# Altium project PIC24E_Extension_Project.PrjPcb
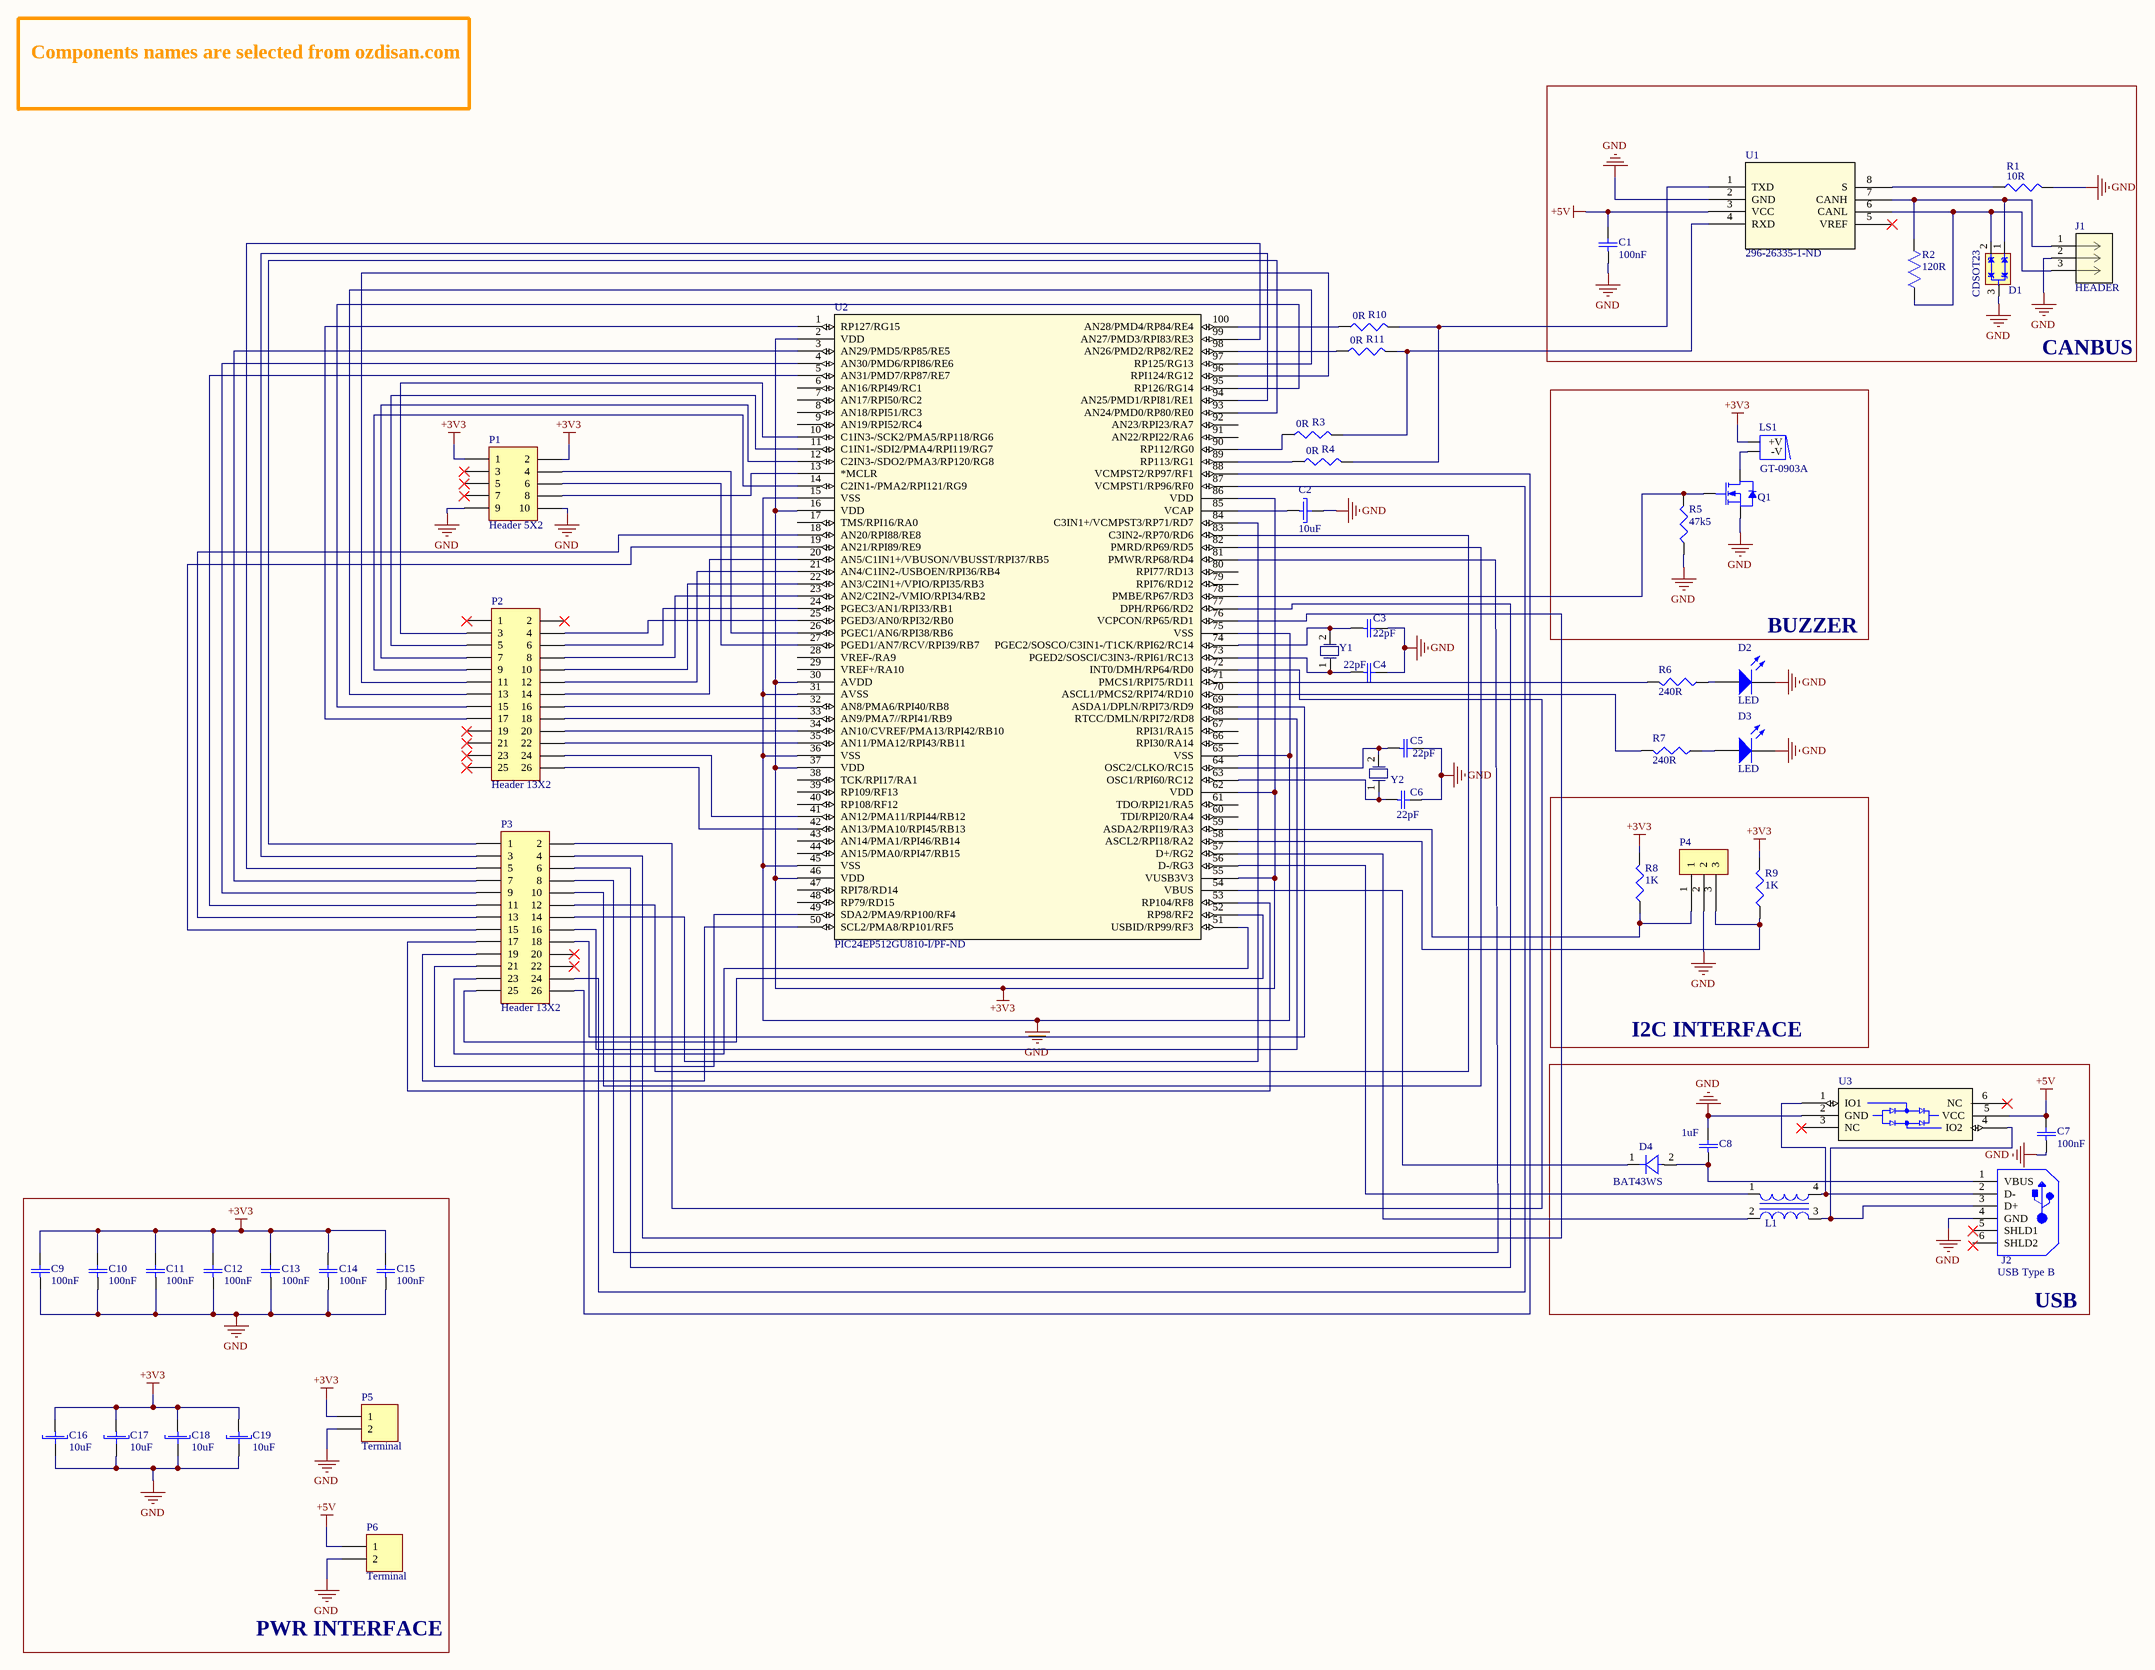
[diagram p0: PIC24E_Extension_Schematics.SchDoc]
1 sheet, 50 parts. Net scope: global (net labels, ports and power ports of the same name join across sheets).
Board file: PIC24E_Extension_PCB.PcbDoc

## Sheet PIC24E_Extension_Schematics.SchDoc
size A2

### Parts
C1  100nF  [C1206]
C2  10uF  [C1206 - TANT]
C3  22pF  [C1206]
C4  22pF  [C1206]
C5  22pF  [C1206]
C6  22pF  [C1206]
C7  100nF  [C1206]
C8  1uF  [C1206]
C9  100nF  [C1206]
C10  100nF  [C1206]
C11  100nF  [C1206]
C12  100nF  [C1206]
C13  100nF  [C1206]
C14  100nF  [C1206]
C15  100nF  [C1206]
C16  10uF  [C1206 - TANT]
C17  10uF  [C1206 - TANT]
C18  10uF  [C1206 - TANT]
C19  10uF  [C1206 - TANT]
D1  CDSOT23  [SOT-23-3]
D2  LED  [D0603_Directional]
D3  LED  [D0603_Directional]
D4  BAT43WS  [SOD323]
J1  HEADER  [TerminalBlock3P508]
J2  USB Type B  [USB-B RECEPTACLE]
L1  ACM2012-900-2P-T002  [ACM2012]  (value not drawn)
LS1  GT-0903A  [GT-0903A]
P1  Header 5X2  [HDR2X5]
P2  Header 13X2  [HDR2X13]
P3  Header 13X2  [HDR2X13]
P4  76384-303LF  [HDR_1x3_2.54MM_SHDR_V2]  (value not drawn)
P5  Terminal  [SRW_TRM]
P6  Terminal  [SRW_TRM]
Q1  MOSFET N-CH 20V 1A SOT323  [SC70_SOT323]  (value not drawn)
R1  10R  [R1206]
R2  120R  [R1206]
R3  0R  [R1206]
R4  0R  [R1206]
R5  47k5  [R1206]
R6  240R  [R1206]
R7  240R  [R1206]
R8  1K  [R1206]
R9  1K  [R1206]
R10  0R  [R1206]
R11  0R  [R1206]
U1  296-26335-1-ND  [D8]
U2  PIC24EP512GU810-I/PF-ND  [TQFP100_14x14MC]
U3  TVS DIODE 5V 8.1V SOT23-6  [21-0058I]  (value not drawn)
Y1  XTAL-32.7680kHz  [C0805 - OSC]  (value not drawn)
Y2  XTAL-8MHz  [HC49/US]  (value not drawn)

### Blocks framed on the sheet
CANBUS: C1 D1 J1 R1 R2 U1
BUZZER: LS1 Q1 R5
I2C INTERFACE: P4 R8 R9
USB: C7 C8 D4 J2 L1 U3
PWR INTERFACE: C9-C19 P5 P6

### Nets
+3V3: C9.2 C10.2 C11.2 C12.2 C13.2 C14.2 C15.2 C16.1 C17.1 C18.1 C19.1 LS1.1(+V) P1.1 P1.2 P5.1 R8.2 R9.2 U2.2(VDD) U2.16(VDD) U2.30(AVDD) U2.37(VDD) U2.46(VDD) U2.55(VUSB3V3) U2.62(VDD) U2.86(VDD)
+5V: C1.2 C7.2 P6.1 U1.3(VCC) U3.5(VCC)
GND: C1.1 C2.2 C3.2 C4.2 C5.2 C6.2 C7.1 C8.2 C9.1 C10.1 C11.1 C12.1 C13.1 C14.1 C15.1 C16.2 C17.2 C18.2 C19.2 D1.3 D2.2(K) D3.2(K) J1.2 J2.4(GND) P1.9 P1.10 P4.2 P5.2 P6.2 Q1.2(S) R1.2 R5.1 U1.2(GND) U2.15(VSS) U2.31(AVSS) U2.36(VSS) U2.45(VSS) U2.65(VSS) U2.75(VSS) U3.2(GND)
NetC2_1: C2.1 U2.85(VCAP)
NetC3_1: C3.1 U2.74(PGEC2/SOSCO/C3IN1-/T1CK/RPI62/RC14) Y1.2
NetC4_1: C4.1 U2.73(PGED2/SOSCI/C3IN3-/RPI61/RC13) Y1.1
NetC5_1: C5.1 U2.64(OSC2/CLKO/RC15) Y2.2
NetC6_1: C6.1 U2.63(OSC1/RPI60/RC12) Y2.1
NetC8_1: C8.1 D4.2 J2.1(VBUS)
NetD1_1: D1.1 J1.1 R2.2 U1.7(CANH)
NetD1_2: D1.2 J1.3 R2.1 U1.6(CANL)
NetD2_1: D2.1(A) R6.1
NetD3_1: D3.1(A) R7.1
NetD4_1: D4.1 U2.54(VBUS)
NetJ2_2: J2.2(D-) L1.4 U3.1(IO1)
NetJ2_3: J2.3(D+) L1.3 U3.4(IO2)
NetL1_1: L1.1 U2.56(D-/RG3)
NetL1_2: L1.2 U2.57(D+/RG2)
NetLS1_2: LS1.2(-V) Q1.3(D)
NetP1_4: P1.4 U2.26(PGEC1/AN6/RPI38/RB6)
NetP1_6: P1.6 U2.27(PGED1/AN7/RCV/RPI39/RB7)
NetP1_8: P1.8 U2.13(*MCLR)
NetP2_3: P2.3 U2.10(C1IN3-/SCK2/PMA5/RP118/RG6)
NetP2_4: P2.4 U2.25(PGED3/AN0/RPI32/RB0)
NetP2_5: P2.5 U2.11(C1IN1-/SDI2/PMA4/RPI119/RG7)
NetP2_6: P2.6 U2.24(PGEC3/AN1/RPI33/RB1)
NetP2_7: P2.7 U2.12(C2IN3-/SDO2/PMA3/RP120/RG8)
NetP2_8: P2.8 U2.23(AN2/C2IN2-/VMIO/RPI34/RB2)
NetP2_9: P2.9 U2.14(C2IN1-/PMA2/RPI121/RG9)
NetP2_10: P2.10 U2.22(AN3/C2IN1+/VPIO/RPI35/RB3)
NetP2_11: P2.11 U2.96(RPI124/RG12)
NetP2_12: P2.12 U2.21(AN4/C1IN2-/USBOEN/RPI36/RB4)
NetP2_13: P2.13 U2.97(RP125/RG13)
NetP2_14: P2.14 U2.20(AN5/C1IN1+/VBUSON/VBUSST/RPI37/RB5)
NetP2_15: P2.15 U2.95(RP126/RG14)
NetP2_16: P2.16 U2.32(AN8/PMA6/RPI40/RB8)
NetP2_17: P2.17 U2.1(RP127/RG15)
NetP2_18: P2.18 U2.33(AN9/PMA7//RPI41/RB9)
NetP2_20: P2.20 U2.34(AN10/CVREF/PMA13/RPI42/RB10)
NetP2_22: P2.22 U2.35(AN11/PMA12/RPI43/RB11)
NetP2_24: P2.24 U2.41(AN12/PMA11/RPI44/RB12)
NetP2_26: P2.26 U2.42(AN13/PMA10/RPI45/RB13)
NetP3_1: P3.1 U2.93(AN24/PMD0/RP80/RE0)
NetP3_2: P3.2 U2.72(INT0/DMH/RP64/RD0)
NetP3_3: P3.3 U2.94(AN25/PMD1/RPI81/RE1)
NetP3_4: P3.4 U2.76(VCPCON/RP65/RD1)
NetP3_5: P3.5 U2.99(AN27/PMD3/RPI83/RE3)
NetP3_6: P3.6 U2.77(DPH/RP66/RD2)
NetP3_7: P3.7 U2.3(AN29/PMD5/RP85/RE5)
NetP3_8: P3.8 U2.81(PMWR/RP68/RD4)
NetP3_9: P3.9 U2.4(AN30/PMD6/RPI86/RE6)
NetP3_10: P3.10 U2.82(PMRD/RP69/RD5)
NetP3_11: P3.11 U2.5(AN31/PMD7/RP87/RE7)
NetP3_12: P3.12 U2.83(C3IN2-/RP70/RD6)
NetP3_13: P3.13 U2.18(AN20/RPI88/RE8)
NetP3_14: P3.14 U2.84(C3IN1+/VCMPST3/RP71/RD7)
NetP3_15: P3.15 U2.19(AN21/RPI89/RE9)
NetP3_16: P3.16 U2.68(RTCC/DMLN/RPI72/RD8)
NetP3_17: P3.17 U2.53(RP104/RF8)
NetP3_18: P3.18 U2.69(ASDA1/DPLN/RPI73/RD9)
NetP3_19: P3.19 U2.50(SCL2/PMA8/RP101/RF5)
NetP3_21: P3.21 U2.49(SDA2/PMA9/RP100/RF4)
NetP3_23: P3.23 U2.51(USBID/RP99/RF3)
NetP3_24: P3.24 U2.87(VCMPST1/RP96/RF0)
NetP3_25: P3.25 U2.52(RP98/RF2)
NetP3_26: P3.26 U2.88(VCMPST2/RP97/RF1)
NetP4_1: P4.1 R8.1 U2.59(ASDA2/RPI19/RA3)
NetP4_3: P4.3 R9.1 U2.58(ASCL2/RPI18/RA2)
NetQ1_1: Q1.1(G) R5.2 U2.78(PMBE/RP67/RD3)
NetR1_1: R1.1 U1.8(S)
NetR3_1: R3.1 U2.90(RP112/RG0)
NetR3_2: R3.2 R11.2 U1.4(RXD)
NetR4_1: R4.1 U2.89(RP113/RG1)
NetR4_2: R4.2 R10.2 U1.1(TXD)
NetR6_2: R6.2 U2.71(PMCS1/RPI75/RD11)
NetR7_2: R7.2 U2.70(ASCL1/PMCS2/RPI74/RD10)
NetR10_1: R10.1 U2.100(AN28/PMD4/RP84/RE4)
NetR11_1: R11.1 U2.98(AN26/PMD2/RP82/RE2)

Not connected (* = marked no-connect by the designer): J2 5(SHLD1)* 6(SHLD2); P1 3* 5* 7*; P2 1* 2* 19* 21* 23* 25*; P3 20* 22*; U1 5(VREF)*; U2 6(AN16/RPI49/RC1) 7(AN17/RPI50/RC2) 8(AN18/RPI51/RC3) 9(AN19/RPI52/RC4) 17(TMS/RPI16/RA0) 28(VREF-/RA9) 29(VREF+/RA10) 38(TCK/RPI17/RA1) 39(RP109/RF13) 40(RP108/RF12) 43(AN14/PMA1/RPI46/RB14) 44(AN15/PMA0/RPI47/RB15) 47(RPI78/RD14) 48(RP79/RD15) 60(TDI/RPI20/RA4) 61(TDO/RPI21/RA5) 66(RPI30/RA14) 67(RPI31/RA15) 79(RPI76/RD12) 80(RPI77/RD13) 91(AN22/RPI22/RA6) 92(AN23/RPI23/RA7); U3 3(NC)* 6(NC)*

### Notes on the sheet
- Components names are selected from ozdisan.com

### Library data of the parts
C1 C7 C9-C15 = CL05A104KA5NNNC: MLCC (3216) 1206 100nF 100VDC ±10% X7R; Product Name: CL31B104KCFNNNE; Applications: General Purpose
C2 C16-C19 = T491A106K016AT: CAP.TANTAL 10uF 16V 10% A CASE (3216) SMD; Product Name: T491A106K016AT
C3-C6 = CL21A226MOCLRNC: MLCC (3216) 1206 22pF 50VDC ±5% C0G (NP0); Product Name: CL31C220JBCNNNC
C8 = CGA5L3X8R1H105K1: MLCC (3216) 1206 1uF 16VDC ±5% X7R; Product Name: CL31B105JOFNNNE
D1 = CDSOT23: DIODE TVS 24VWM 40VC SOT23; Product Name: CDSOT23-T24CAN
D2 D3 = LS Q976-NR-1: LED RED DIFFUSED 0603 SMD; Manufacturer 1: OSRAM Opto Semiconductors Inc.; Lens Color: White; Millicandela Rating: 104mcd; Lens Style/Size: Rectangle with Flat Top, 1.00mm x 0.80mm; Voltage - Forward (Vf) (Typ): 2V; Current - Test: 20mA; Viewing Angle: 160°; Wavelength - Dominant: 633nm; Wavelength - Peak: 645nm; Published: 8-Jun-2000; LatestRevisionDate: 08-Jul-2005; LatestRevisionNote: Mech Layer 1 removed.; PackageReference: LED-0; Publisher: Altium Limited; PackageDescription: LED; 2 Leads; Supplier 1: Digi-Key; Supplier Part Number 1: 475-2512-1-ND; Manufacturer Part Number 1: LS Q976-NR-1; RoHS: RoHS Compliant; Description 1: LED RED DIFFUSED 0603 SMD; Category: Optoelectronics; Stock 1: 127302; Pricing 1: 1=0.38, 10=0.274, 25=0.202, 100=0.1444, 250=0.0982, 500=0.08664, 1000=0.06787 (USD); Packaging: Cut Tape (CT); Part Status: Active; Color: Red; Lens Transparency: Diffused; Mounting Type: Surface Mount; Features: -; Package / Case: 0603 (1608 Metric); Supplier Device Package: 0603; Size / Dimension: 1.60mm L x 0.80mm W; Height (Max): 0.80mm; ComponentLink1URL: https://dammedia.osram.info/media/resource/hires/osram-dam-2493499/LS%20Q976.pdf; ComponentLink1Description: https://dammedia.osram.info/media/resource/hires/osram-dam-2493499/LS%20Q976.pdf
D4 = BAT43WS-7-F: DIODE SCHOTTKY 30V 200MA SOD323; Manufacturer 1: Diodes Incorporated; Current - Average Rectified (Io): 200mA (DC); Speed: Small Signal =< 200mA (Io), Any Speed; Capacitance @ Vr, F: 10pF @ 1V, 1MHz; Manufacturer Part Number 1: BAT43WS-7-F; RoHS: RoHS Compliant; Stock 1: 45041; Pricing 1: 1=0.47, 10=0.352, 100=0.2028, 500=0.13698, 1000=0.10685 (USD); Packaging: Cut Tape (CT); Part Status: Active; Diode Type: Schottky; Mounting Type: Surface Mount; Package / Case: SC-76, SOD-323; Supplier Device Package: SOD-323; Operating Temperature - Junction: -55°C ~ 125°C; Base Part Number: BAT43WS; ComponentLink1URL: https://www.diodes.com/assets/Datasheets/ds30100.pdf; ComponentLink1Description: https://www.diodes.com/assets/Datasheets/ds30100.pdf; Supplier 1: Digi-Key; Supplier Part Number 1: BAT43WS-FDICT-ND; Description 1: DIODE SCHOTTKY 30V 200MA SOD323; Category: Discrete Semiconductor Products
J1 = 796644-3: PIN HEADER 3PIN(1x3) 2.00mm THT V/T; Product Name: L-KLS1-207B-1-03-S
J2 = 292304-1: CONNECTOR USB B TYPE RIGHT ANGLE 90C CONNFLY; Product Name: DS1099-WN0
L1 = ACM2012-900-2P-T002: CHOKE COMM MODE 90 OHM .4A SMD; Manufacturer: TDK Corporation; Filter Type: Data, Signal Line; Number of Lines: 2; Current: 400mA; DC Resistance (DCR): 190 mOhm Max; Impedance: 90 Ohm; Resistance (Ohms): 8.2K; Power (Watts): 0.063W, 1/16W; Temperature Coefficient: ±100ppm/°C; Tolerance: ±1%; .Checked PCB: CHK; Supplier 1: Digi-Key; Supplier Part Number 1: 445-2207-1-ND; Manufacturer Part Number: ACM2012-900-2P-T002; RoHS: RoHS Compliant; Category: Filters; Stock 1: 175768; Pricing 1: 1=0.48, 10=0.448, 50=0.42, 100=0.364, 500=0.308, 1000=0.252 (USD); Inductance: -; Mounting Type: Surface Mount; Size / Dimension: 0.079" L x 0.047" W (2.00mm x 1.20mm); Height (Max): 0.051" (1.30mm); Package / Case: 0805 (2012 Metric), 4 Lead; Operating Temperature: -25°C ~ 85°C; Packaging: Cut Tape (CT); ComponentLink1URL: http://www.tdk.co.jp/tefe02/e9719_acm2012.pdf; ComponentLink1Description: http://www.tdk.co.jp/tefe02/e9719_acm2012.pdf; Composition: Thick Film; Features: -; Height: 0.016" (0.40mm); Number of Terminations: 2; ComponentLink2URL: http://www.yageo.com/documents/recent/PYu-RC0402_51_RoHS_L_6.pdf; ComponentLink2Description: http://www.yageo.com/documents/recent/PYu-RC0402_51_RoHS_L_6.pdf; .Checked SCH: CHK
LS1 = GT-0903A: AUDIO MAGNETIC XDCR 2-4V TH; Manufacturer 1: Soberton Inc.; Driver Circuitry: Transducer, Externally Driven; Input Type: Zero-Peak Signal; Voltage Range: 2 ~ 4V; Frequency: 2.73kHz; Operating Mode: Single Tone; Sound Pressure Level (SPL): 85dB @ 3V, 10cm; Current - Supply: 80mA; Port Location: Top; Supplier 1: Digi-Key; Supplier Part Number 1: 433-1032-ND; Manufacturer Part Number 1: GT-0903A; RoHS: RoHS Compliant; Description 1: AUDIO MAGNETIC XDCR 2-4V TH; Category: Audio Products; Stock 1: 13944; Pricing 1: 1=0.97, 10=0.774, 25=0.7036, 50=0.658, 100=0.6125, 250=0.56, 500=0.5215, 1000=0.4865, 5000=0.4375 (USD); Packaging: Tray; Part Status: Active; Technology: Magnetic; Duration: -; Operating Temperature: -20°C ~ 60°C; Approvals: -; Ratings: -; Mounting Type: Through Hole; Termination: PC Pins; Size / Dimension: 0.354" Dia (9.00mm); Height - Seated (Max): 0.197" (5.00mm); ComponentLink1URL: http://cirlw3yrzg4afc1x47lv2k18.wpengine.netdna-cdn.com/wp-content/uploads/2016/10/GT-0903A-Rev.A_2016-1.pdf; ComponentLink1Description: http://cirlw3yrzg4afc1x47lv2k18.wpengine.netdna-cdn.com/wp-content/uploads/2016/10/GT-0903A-Rev.A_2016-1.pdf
P1 = Header 5X2: CONNECTOR 2.54MM 10P (5X2) MALE; Product Name: 67997-410HLF
P2 P3 = Header 13X2: PIN HEADER 26PIN(2x13) 2.54mm THT V/T MALE 180 C; Product Name: DS1021-2X13SF11-B
P4 = 76384-303LF: CONN HEADER 3POS .100" STR GOLD; Manufacturer: FCI; Connector Type: Header, Shrouded; Number of Positions: 3; Number of Positions Loaded: All; Pitch: 0.100" (2.54mm); .Creator: MM; .Checked PCB: CHK; Supplier 1: Digi-Key; Manufacturer Part Number: 76384-303LF; RoHS: RoHS Compliant; Category: Connectors, Interconnects; Stock 1: 1441; Pricing 1: 1=0.59, 10=0.556, 25=0.5, 50=0.4444, 100=0.426, 250=0.38892, 500=0.3704, 1000=0.30558, 2500=0.2778 (USD); Packaging: Tube; Contact Type: Male Pin; Number of Rows: 1; Row Spacing: -; Contact Mating Length: 0.197" (5.00mm); Mounting Type: Through Hole; Termination: Solder; Fastening Type: Friction Lock; Features: -; Contact Finish: Gold, GXT™; Contact Finish Thickness: 30µin (0.76µm); Color: Black; ComponentLink1URL: http://portal.fciconnect.com/Comergent//fci/drawing/76384.pdf; ComponentLink1Description: http://portal.fciconnect.com/Comergent//fci/drawing/76384.pdf; Supplier Part Number 1: 609-1305-ND; .Checked SCH: CHK
P5 = Header 2: TERM.BLK.3.50MM 2P PCB TYPE GREEN; Product Name: DG350-3.5-02P-14-02AH
P6 = Header 2: TERM.BLK.5.00MM 3P PCB TYPE 0 BOY GREEN GOLTEN; Product Name: GT126-5.0-03P-14-00AH
Q1 = DMG1012UW-7: Manufacturer 1: Diodes Incorporated; Note: Pin 2 is electrically connected to pin 4.; FET Type: N-Channel; Current - Continuous Drain (Id) @ 25°C: 1A (Ta); Drive Voltage (Max Rds On,  Min Rds On): 1.8V, 4.5V; Rds On (Max) @ Id, Vgs: 450 mOhm @ 600mA, 4.5V; Vgs(th) (Max) @ Id: 1V @ 250µA; Vgs (Max): ±6V; Power Dissipation (Max): 290mW (Ta); Published: 8-Jun-2000; LatestRevisionDate: 17-Jul-2002; LatestRevisionNote: Re-released for DXP Platform.; DatasheetVersion: PD-9.814; PackageReference: TO-220AB; Publisher: Altium Limited; Code_JEDEC: TO-220-AB; ComponentLink1Description: Manufacturer Link; ComponentLink1URL: http://www.irf.com/; Digikey P/N: DMG1012UW-7DITR-ND; Supplier 1: Digi-Key; Supplier Part Number 1: DMG1012UW-7DICT-ND; Manufacturer Part Number 1: DMG1012UW-7; RoHS: RoHS Compliant; Description 1: MOSFET N-CH 20V 1A SOT323; Category: Discrete Semiconductor Products; Stock 1: 211076; Pricing 1: 1=0.41, 10=0.37, 100=0.2074, 500=0.1111, 1000=0.07554 (USD); Packaging: Cut Tape (CT); Part Status: Active; Technology: MOSFET (Metal Oxide); FET Feature: -; Operating Temperature: -55°C ~ 150°C (TJ); Mounting Type: Surface Mount; Supplier Device Package: SOT-323; Package / Case: SC-70, SOT-323; ComponentLink2URL: https://www.diodes.com/assets/Datasheets/ds31859.pdf; ComponentLink2Description: https://www.diodes.com/assets/Datasheets/ds31859.pdf
R1 = RC0402FR-0710RL: RES.(3216) 1206 10 Ohms 1% 1/4W-S 400PPM; Product Name: 1206S4F100JT5E
R2 = RL1632R-R120-F: RES.(3216) 1206 120 Ohms 1% 1/4W-S 100PPM; Product Name: 1206S4F1200T5E
R3 R4 R10 R11 = RC0402FR-0710RL: RES.(3216) 1206 0 Ohms 5% 1/4W-S 800PPM; Product Name: 1206S4J0000TDE
R5 = RC0402FR-0747K5L: RES.(3216) 1206 47.5K Ohms 1% 1/4W-S 100PPM; Product Name: 1206S4F4752T5E
R6 R7 = RMCF0402FT240R: RES.(3216) 1206 240 Ohms 1% 1/4W-S 100PPM; Product Name: 1206S4F2400T5E
R8 R9 = ERJ-2RKF1001X: RES.(3216) 1206 1K Ohms 1% 1/4W-S 100PPM; Product Name: 1206S4F1001T5E
U1 = SN65HVD1050DR: IC EMC CAN TRANSCEIVER 8-SOIC; Manufacturer: Texas Instruments; Built_By: EMA_UL_Team; C: Copyright (C) 2015 Accelerated Designs. All rights reserved; Protocol: CANbus; Number of Drivers/Receivers: 1/1; Duplex: Half; Voltage - Supply: 4.5 V ~ 5.5 V; .Checked PCB: CHK; Vendor: Texas Instruments; Manufacturer_Part_Number: SN65HVD1050DR; RefDes: RefDes; Type: DEV; Value: Value; Manufacturer 1: Texas Instruments; Manufacturer Part Number 1: SN65HVD1050DR; RoHS: RoHS Compliant; Stock 1: 82774; Pricing 1: 1=1.36, 10=1.215, 100=0.9476, 500=0.7828, 1000=0.618 (USD); Packaging: Cut Tape (CT); Part Status: Active; Data Rate: -; Operating Temperature: -40°C ~ 125°C; Mounting Type: Surface Mount; Package / Case: 8-SOIC (0.154", 3.90mm Width); Supplier Device Package: 8-SOIC; Base Part Number: SN65HVD1050; ComponentLink1URL: http://www.ti.com/lit/ds/symlink/sn65hvd1050.pdf; ComponentLink1Description: http://www.ti.com/lit/ds/symlink/sn65hvd1050.pdf; Supplier 1: Digi-Key; Supplier Part Number 1: 296-26335-1-ND; Description 1: IC EMC CAN TRANSCEIVER 8-SOIC; Category: Integrated Circuits (ICs); .Checked SCH: CHK
U2 = PIC24EP512GU810-: IC MCU 16BIT 512KB FLASH 100TQFP; Manufacturer_Part_Number: PIC24EP512GU810-I/PT; Manufacturer 1: Microchip Technology; Vendor: Microchip; Built_By: EMA_UL_Team; C: Copyright (C) 2015 Accelerated Designs. All rights reserved; .Checked PCB: CHK; Core Processor: PIC; Core Size: 16-Bit; Speed: 60 MIPs; Connectivity: CANbus, I²C, IrDA, LINbus, SPI, UART/USART, USB OTG; Peripherals: Brown-out Detect/Reset, DMA, POR, PWM, WDT; Program Memory Size: 512KB (170K x 24); RAM Size: 24K x 16; Voltage - Supply (Vcc/Vdd): 3 V ~ 3.6 V; Data Converters: A/D 32x10b/12b; Oscillator Type: Internal; RefDes: RefDes; Type: Type; Value: Value; .Checked SCH: CHK; Supplier 1: Digi-Key; Supplier Part Number 1: PIC24EP512GU810-I/PF-ND; Manufacturer Part Number 1: PIC24EP512GU810-I/PF; RoHS: RoHS Compliant; Description 1: IC MCU 16BIT 512KB FLASH 100TQFP; Category: Integrated Circuits (ICs); Stock 1: 5419; Pricing 1: 1=9.23, 25=8.4668 (USD); Packaging: Tray; Part Status: Active; Program Memory Type: FLASH; EEPROM Size: -; Operating Temperature: -40°C ~ 85°C (TA); Package / Case: 100-TQFP; Supplier Device Package: 100-TQFP (14x14); Base Part Number: PIC24EP512GU810; ComponentLink1URL: http://www.microchip.com/mymicrochip/filehandler.aspx?ddocname=en554454; ComponentLink1Description: http://www.microchip.com/mymicrochip/filehandler.aspx?ddocname=en554454
U3 = MAX3207EAUT+T: MAX3207E; Manufacturer 1: Maxim Integrated; Vendor: Maxim Integrated Products; Built_By: EMA_UL_Team; C: Copyright (C) 2015 Accelerated Designs. All rights reserved; Power Line Protection: Yes; Description 1: TVS DIODE SOT23-6; .Checked PCB: CHK; Manufacturer_Part_Number: MAX3207EAUT+T; RefDes: RefDes; Type: DEV; Value: Value; Manufacturer Part Number 1: MAX3207EAUT+T; RoHS: RoHS Compliant; Stock 1: 8902; Pricing 1: 1=1.3, 10=1.224, 25=0.9792, 50=0.9302, 100=0.8568, 250=0.81276, 500=0.78336 (USD); Packaging: Cut Tape (CT); Part Status: Active; Voltage - Reverse Standoff (Typ): -; Voltage - Breakdown (Min): -; Voltage - Clamping (Max) @ Ipp: -; Current - Peak Pulse (10/1000µs): -; Power - Peak Pulse: -; Applications: USB OTG; Capacitance @ Frequency: -; Operating Temperature: -40°C ~ 125°C (TA); Mounting Type: Surface Mount; Package / Case: SOT-23-6; Supplier Device Package: SOT-23-6; Base Part Number: MAX3207E; ComponentLink1URL: https://datasheets.maximintegrated.com/en/ds/MAX3205E-MAX3208E.pdf; ComponentLink1Description: https://datasheets.maximintegrated.com/en/ds/MAX3205E-MAX3208E.pdf; Supplier 1: Digi-Key; Supplier Part Number 1: MAX3207EAUT+TCT-ND; Category: Circuit Protection; .Checked SCH: CHK
Y1 = Crystal-8MHz: CRYSTAL 32.7680kHz 20ppm 12.5pF SMD; Product Name: ABS06-32.768KHZ-T
Y2 = Crystal-8MHz: CRYSTAL 8.0000MHZ 18PF SMD; Product Name: ABLS-8.000MHZ-B2-T